# EAGLE design solenoid_driver_RJ45_1_0 (EAGLE 6.6.0)
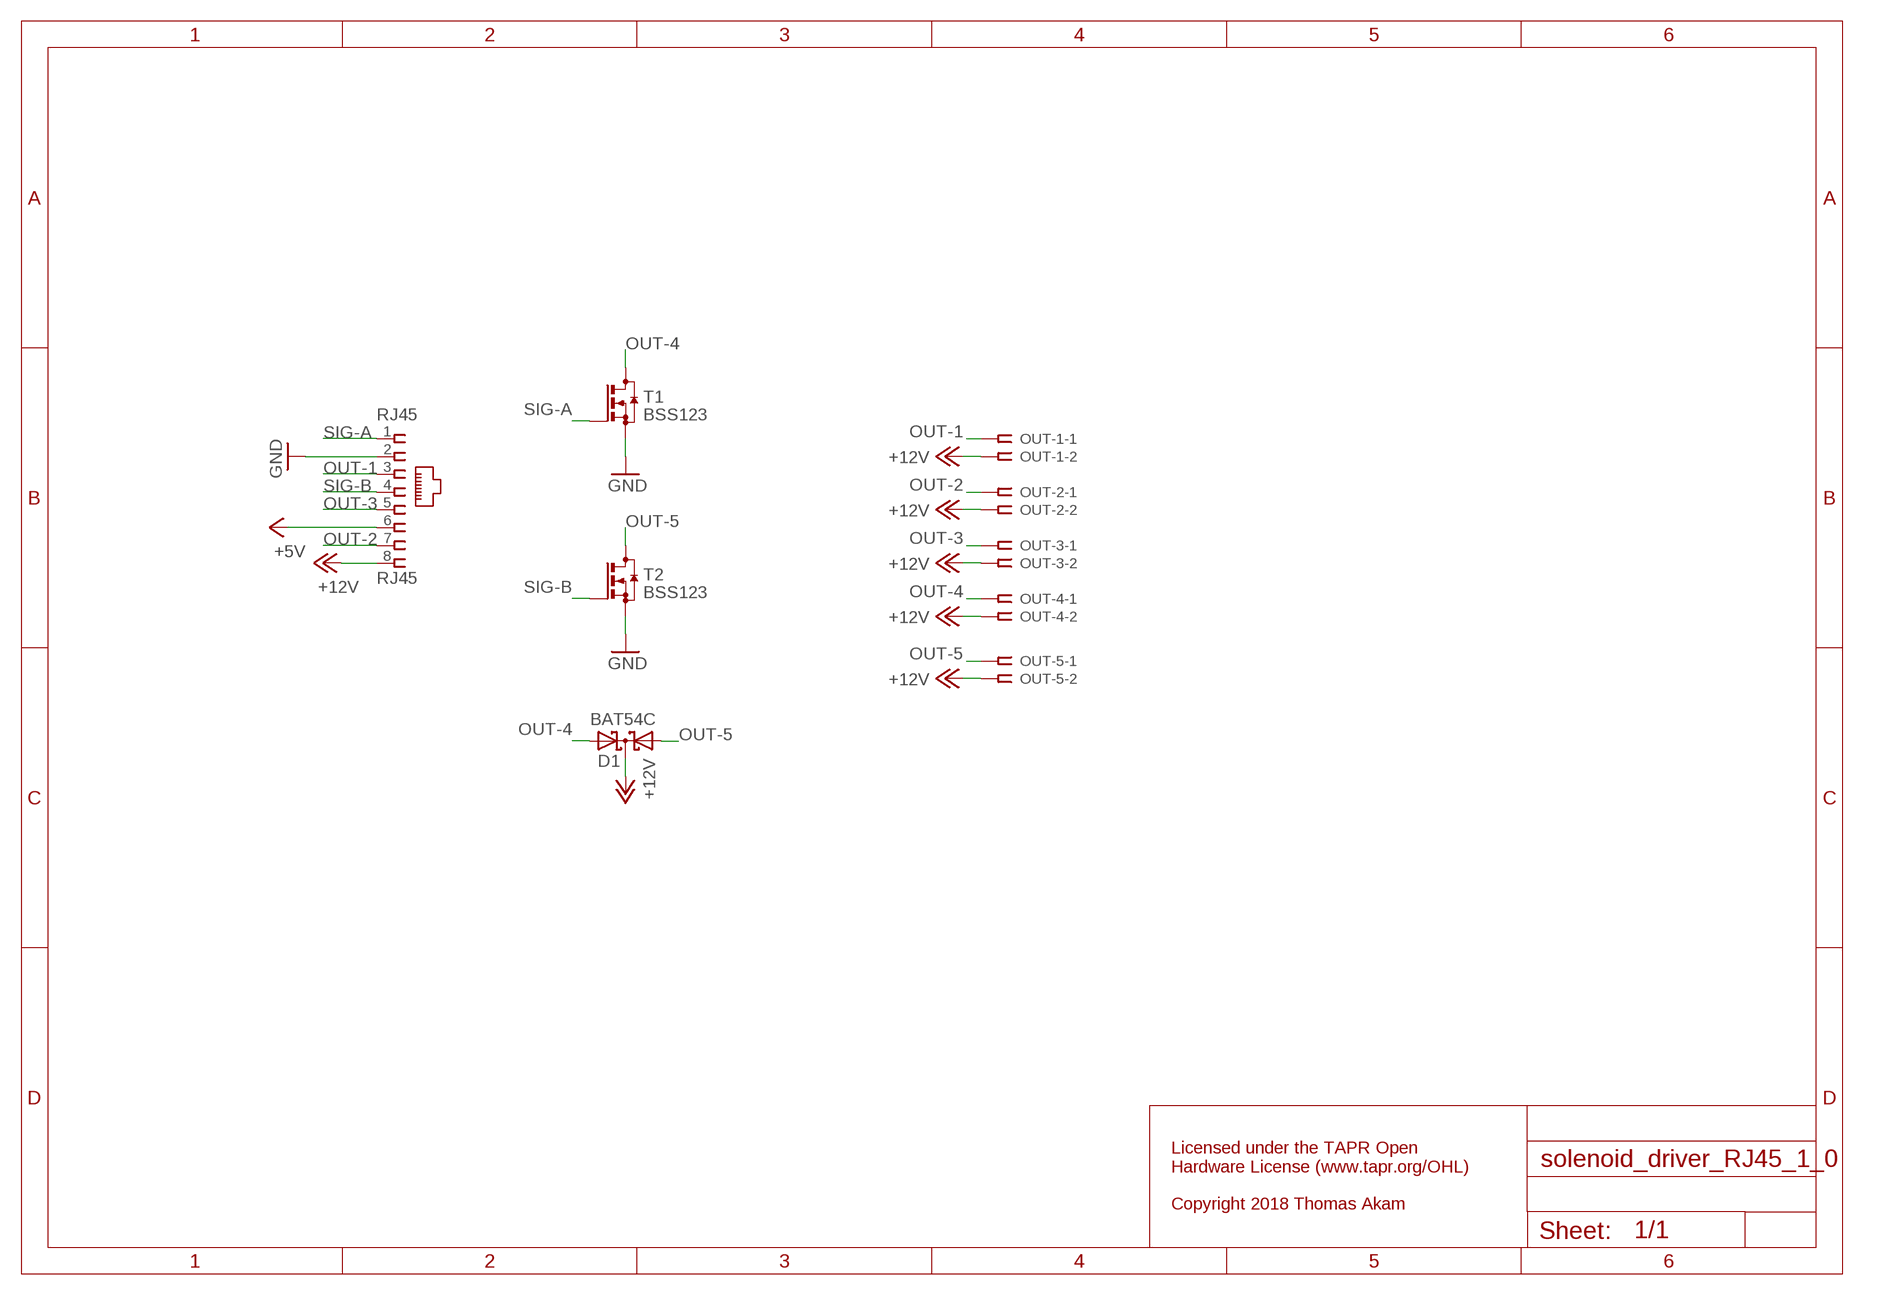
[diagram p0: schematic, sheet 1]

## Parts
D1  BAT54C  [SOT23]
OUT-1  SSW-102-02-S-S-RA  [SSW-102-02-S-S-RA]
OUT-2  SSW-102-02-S-S-RA  [SSW-102-02-S-S-RA]
OUT-3  SSW-102-02-S-S-RA  [SSW-102-02-S-S-RA]
OUT-4  SSW-102-02-S-S-RA  [SSW-102-02-S-S-RA]
OUT-5  SSW-102-02-S-S-RA  [SSW-102-02-S-S-RA]
RJ45  RJ45  RJ45VERTICAL  [RJ45-NO-SHIELD-VERTICAL]
T1  BSS123  [SOT23]
T2  BSS123  [SOT23]

## Nets
+5V: RJ45.6
+12V: D1.3(CC) OUT-1.2 OUT-2.2 OUT-3.2 OUT-4.2 OUT-5.2 RJ45.8
GND: RJ45.2 T1.2(S) T2.2(S)
OUT-1: OUT-1.1 RJ45.3
OUT-2: OUT-2.1 RJ45.7
OUT-3: OUT-3.1 RJ45.5
OUT-4: D1.2(A2) OUT-4.1 T1.3(D)
OUT-5: D1.1(A1) OUT-5.1 T2.3(D)
SIG-A: RJ45.1 T1.1(G)
SIG-B: RJ45.4 T2.1(G)

## Notes on the sheet
- Licensed under the TAPR Open
  Hardware License (www.tapr.org/OHL)
  
  Copyright 2018 Thomas Akam

## Library data of the parts
D1 = diode:BAT54C: Schottky Diodes Source: Fairchild .. BAT54.pdf
OUT-1-OUT-5 = con-samtec:SSW-102-02-S-S: THROUGH-HOLE .025" SQ POST SOCKET Source: Samtec SSW.pdf; MPN: SSW-102-02-S-S-RA; OC_FARNELL: unknown; OC_NEWARK: 11P9352
RJ45 = con-tycoelectronics-vertical_RJ45:RJ45: CORCOM Modular RJ Jacks No Shield Source: www.tycoelectronics.com .. ENG_DS_1654001_1099_RJ_L_0507.pdf
T1 T2 = transistor-small-signal:BSS123: N-CHANNEL MOS FET

## Board
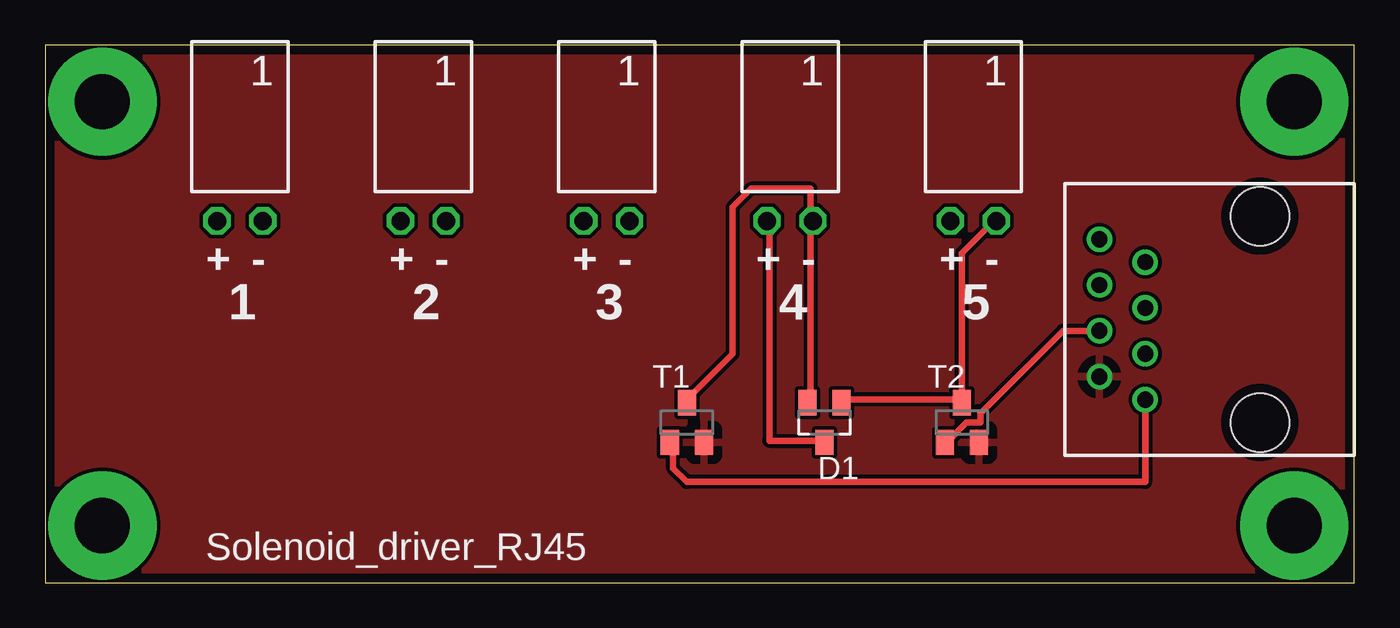
[diagram p1: board, top side]
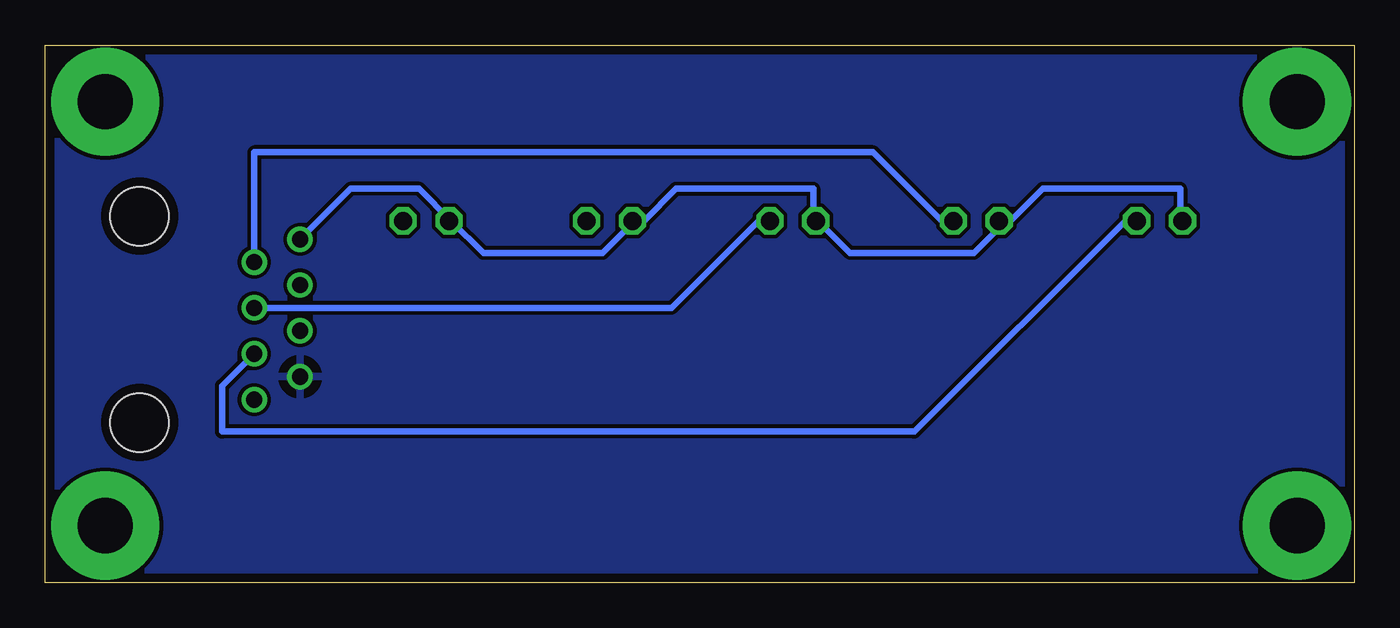
[diagram p2: board, bottom side, seen from below]

Size 72.55 x 29.81 mm. Coordinates in mm from the lower left corner, seen from the top.
Outline: 0,0 72.55,0 72.55,29.81 0,29.81 0,0
Copper layers (1*16): Top 0.035mm / dielectric 1.5mm / Bottom 0.035mm
Design rules "default *": minimum track width 14mil, minimum drill 24mil, track to track 8mil, track to pad 8mil, pad to pad 8mil, via to via 8mil, smd to smd 8mil, copper to edge 20mil, drill to drill 8mil, minimum pad ring 10mil, minimum via ring 8mil, stop-mask expansion 4mil, vias tented up to drill 0mil, thermal gap 20mil
vRestrict: area 6.4,13.3 to 53.3,19.1; area 33.7,5.7 to 54,11.4; area 8.3,0.6 to 36.2,3.2

### Footprints (pad centres in the part's own frame; a part is rotated, then mirrored left to right if it is on the bottom)
SOT23 = smd 1 x 1.4: 1 -0.95,-1.1; 2 0.95,-1.1; 3 0,1.1
SSW-102-02-S-S-RA = drill 1 pad 1.5 octagon: 1 -1.27,1.524; 2 1.27,1.524
RJ45-NO-SHIELD-VERTICAL = drill 0.9 pad 1.4: 1 -4.445,5.08; 2 -3.175,7.62; 3 -1.905,5.08; 4 -0.635,7.62; 5 0.635,5.08; 6 1.905,7.62; 7 3.175,5.08; 8 4.445,7.62 | hole 3.251: -5.715,-1.27; 5.715,-1.27

### Placement (x,y rotation side)
D1  43.18,8.89 180 top
OUT-1  10.79,21.59 180 top
OUT-2  20.95,21.59 180 top
OUT-3  31.11,21.59 180 top
OUT-4  41.27,21.59 180 top
OUT-5  51.44,21.59 180 top
RJ45  66.04,14.61 90 top
T1  35.56,8.89 0 top
T2  50.8,8.89 0 top

### Tracks (layer width: path | path; a pad name or v marks a point on that pad's centre or on a via)
+12V
  Top 0.356: D1.3 43.18,7.87 40.13,7.87 40.13,20.07 OUT-4.2
  Bottom 0.356: 19.3,20.07 OUT-2.2 19.56,20.07 | 19.3,20.07 19.05,20.07 17.27,21.84 9.65,21.84 9.65,20.07 OUT-1.2 | 19.3,20.07 21.08,18.29 27.94,18.29 29.72,20.07 OUT-3.2 29.97,20.07 29.97,21.84 37.59,21.84 39.37,20.07 39.88,20.07 | RJ45.8 55.63,21.84 51.82,21.84 50.04,20.07 | 50.04,20.07 48.26,18.29 41.66,18.29 39.88,20.07 | 50.04,20.07 OUT-5.2 | 39.88,20.07 OUT-4.2
GND
  pour Bottom: 0,0 0,29.84 72.39,29.84 72.39,0
  pour Top: 0,0 72.39,0 72.39,29.84 0,29.84
N$1  (via drill 3.05 pad 6)
  other vias: 69.22,26.67
N$2  (via drill 3.05 pad 6)
  other vias: 3.17,3.17
N$3  (via drill 3.05 pad 6)
  other vias: 3.17,26.67
N$4  (via drill 3.05 pad 6)
  other vias: 69.22,3.17
OUT-1
  Bottom 0.356: RJ45.3 62.74,10.92 62.74,8.38 24.38,8.38 12.7,20.07 OUT-1.1
OUT-2
  Bottom 0.356: RJ45.7 60.96,23.88 26.67,23.88 22.86,20.07 OUT-2.1
OUT-3
  Bottom 0.356: RJ45.5 37.85,15.24 33.02,20.07 OUT-3.1
OUT-4
  Top 0.356: 42.42,20.07 42.42,21.84 39.12,21.84 38.1,20.83 38.1,12.7 35.56,10.16 T1.3 | 42.42,20.07 42.42,10.16 D1.2 | 42.42,20.07 OUT-4.1
OUT-5
  Top 0.356: 50.8,10.16 44.2,10.16 D1.1 | 50.8,10.16 50.8,18.29 52.58,20.07 OUT-5.1 | 50.8,10.16 T2.3
SIG-A
  Top 0.356: RJ45.1 60.96,5.59 35.56,5.59 34.8,6.35 34.8,7.62 T1.1
SIG-B
  Top 0.356: RJ45.4 56.39,13.97 51.82,9.4 51.82,8.89 51.05,8.89 50.04,7.87 T2.1

### Text on the board
tNames: + | - | + | - | + | - | + | - | + | - | 1 | 2 | 3 | 4 | 5 | Solenoid_driver_RJ45